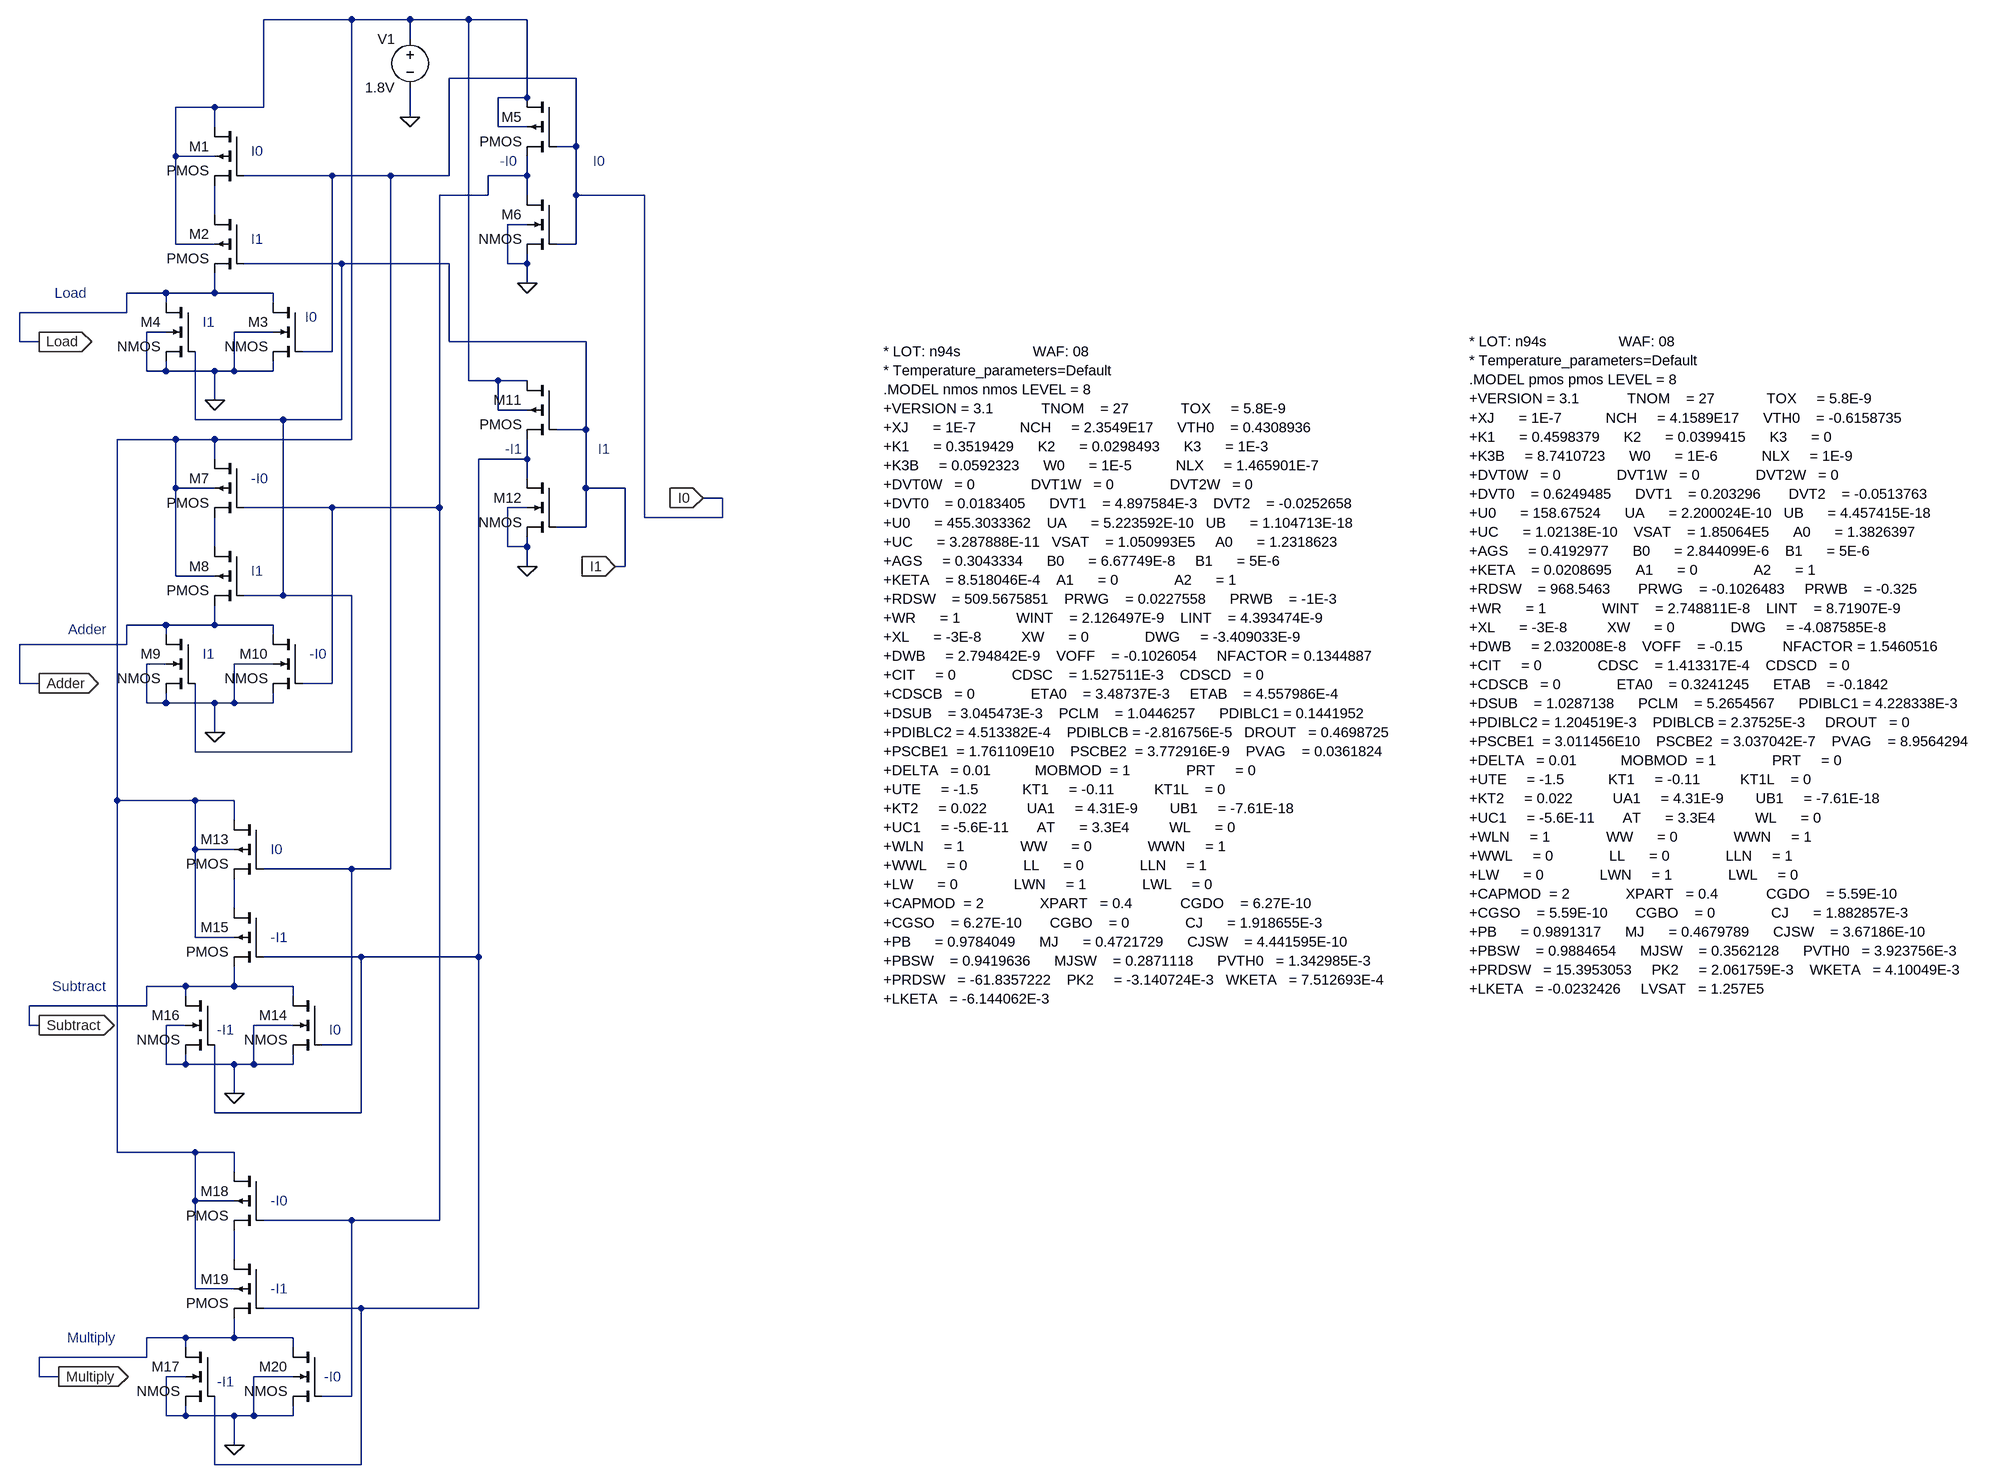
[diagram p0: schematic Command_decoder.asc]
Command_decoder.asc, the LTspice schematic file:
Version 4
SHEET 1 2008 1636
WIRE -704 -736 -848 -736
WIRE -608 -736 -704 -736
WIRE -512 -736 -608 -736
WIRE -416 -736 -512 -736
WIRE -608 -704 -608 -736
WIRE -336 -640 -544 -640
WIRE -416 -608 -416 -736
WIRE -416 -608 -464 -608
WIRE -928 -592 -992 -592
WIRE -848 -592 -848 -736
WIRE -848 -592 -928 -592
WIRE -608 -576 -608 -624
WIRE -928 -560 -928 -592
WIRE -464 -560 -464 -608
WIRE -416 -560 -464 -560
WIRE -336 -528 -336 -640
WIRE -336 -528 -368 -528
WIRE -992 -512 -992 -592
WIRE -928 -512 -992 -512
WIRE -736 -480 -880 -480
WIRE -640 -480 -736 -480
WIRE -544 -480 -544 -640
WIRE -544 -480 -640 -480
WIRE -416 -480 -416 -512
WIRE -416 -480 -480 -480
WIRE -480 -448 -480 -480
WIRE -480 -448 -560 -448
WIRE -416 -448 -416 -480
WIRE -336 -448 -336 -528
WIRE -224 -448 -336 -448
WIRE -928 -416 -928 -464
WIRE -416 -400 -448 -400
WIRE -992 -368 -992 -512
WIRE -928 -368 -992 -368
WIRE -336 -368 -336 -448
WIRE -336 -368 -368 -368
WIRE -720 -336 -880 -336
WIRE -544 -336 -720 -336
WIRE -448 -336 -448 -400
WIRE -416 -336 -416 -352
WIRE -416 -336 -448 -336
WIRE -416 -304 -416 -336
WIRE -1008 -288 -1072 -288
WIRE -928 -288 -928 -320
WIRE -928 -288 -1008 -288
WIRE -832 -288 -928 -288
WIRE -1008 -272 -1008 -288
WIRE -832 -272 -832 -288
WIRE -1072 -256 -1072 -288
WIRE -1072 -256 -1248 -256
WIRE -1008 -224 -1040 -224
WIRE -832 -224 -896 -224
WIRE -1248 -208 -1248 -256
WIRE -1216 -208 -1248 -208
WIRE -544 -208 -544 -336
WIRE -320 -208 -544 -208
WIRE -736 -192 -736 -480
WIRE -736 -192 -784 -192
WIRE -1040 -160 -1040 -224
WIRE -1008 -160 -1008 -176
WIRE -1008 -160 -1040 -160
WIRE -928 -160 -1008 -160
WIRE -896 -160 -896 -224
WIRE -896 -160 -928 -160
WIRE -832 -160 -832 -176
WIRE -832 -160 -896 -160
WIRE -512 -144 -512 -736
WIRE -464 -144 -512 -144
WIRE -416 -144 -464 -144
WIRE -928 -112 -928 -160
WIRE -464 -96 -464 -144
WIRE -416 -96 -464 -96
WIRE -960 -80 -960 -192
WIRE -816 -80 -960 -80
WIRE -720 -80 -720 -336
WIRE -720 -80 -816 -80
WIRE -320 -64 -320 -208
WIRE -320 -64 -368 -64
WIRE -992 -48 -1088 -48
WIRE -928 -48 -992 -48
WIRE -704 -48 -704 -736
WIRE -704 -48 -928 -48
WIRE -928 -16 -928 -48
WIRE -416 -16 -416 -48
WIRE -416 -16 -496 -16
WIRE -416 16 -416 -16
WIRE -992 32 -992 -48
WIRE -928 32 -992 32
WIRE -320 32 -320 -64
WIRE -256 32 -320 32
WIRE -96 48 -128 48
WIRE -736 64 -880 64
WIRE -560 64 -560 -448
WIRE -560 64 -736 64
WIRE -416 64 -448 64
WIRE -224 80 -224 -448
WIRE -96 80 -96 48
WIRE -96 80 -224 80
WIRE -320 96 -320 32
WIRE -320 96 -368 96
WIRE -928 128 -928 80
WIRE -448 128 -448 64
WIRE -416 128 -416 112
WIRE -416 128 -448 128
WIRE -416 160 -416 128
WIRE -256 160 -256 32
WIRE -256 160 -272 160
WIRE -992 176 -992 32
WIRE -928 176 -992 176
WIRE -816 208 -816 -80
WIRE -816 208 -880 208
WIRE -704 208 -816 208
WIRE -1008 256 -1072 256
WIRE -928 256 -928 224
WIRE -928 256 -1008 256
WIRE -832 256 -928 256
WIRE -1008 272 -1008 256
WIRE -832 272 -832 256
WIRE -1072 288 -1072 256
WIRE -1072 288 -1248 288
WIRE -1008 320 -1040 320
WIRE -832 320 -896 320
WIRE -1248 352 -1248 288
WIRE -1216 352 -1248 352
WIRE -736 352 -736 64
WIRE -736 352 -784 352
WIRE -1040 384 -1040 320
WIRE -1008 384 -1008 368
WIRE -1008 384 -1040 384
WIRE -928 384 -1008 384
WIRE -896 384 -896 320
WIRE -896 384 -928 384
WIRE -832 384 -832 368
WIRE -832 384 -896 384
WIRE -928 432 -928 384
WIRE -960 464 -960 352
WIRE -704 464 -704 208
WIRE -704 464 -960 464
WIRE -1088 544 -1088 -48
WIRE -960 544 -1088 544
WIRE -896 544 -960 544
WIRE -896 576 -896 544
WIRE -960 624 -960 544
WIRE -896 624 -960 624
WIRE -704 656 -848 656
WIRE -640 656 -640 -480
WIRE -640 656 -704 656
WIRE -896 720 -896 672
WIRE -960 768 -960 624
WIRE -896 768 -960 768
WIRE -688 800 -848 800
WIRE -496 800 -496 -16
WIRE -496 800 -688 800
WIRE -976 848 -1040 848
WIRE -896 848 -896 816
WIRE -896 848 -976 848
WIRE -800 848 -896 848
WIRE -976 864 -976 848
WIRE -800 864 -800 848
WIRE -1040 880 -1040 848
WIRE -1040 880 -1232 880
WIRE -1232 912 -1232 880
WIRE -1216 912 -1232 912
WIRE -976 912 -1008 912
WIRE -800 912 -864 912
WIRE -704 944 -704 656
WIRE -704 944 -752 944
WIRE -1008 976 -1008 912
WIRE -976 976 -976 960
WIRE -976 976 -1008 976
WIRE -896 976 -976 976
WIRE -864 976 -864 912
WIRE -864 976 -896 976
WIRE -800 976 -800 960
WIRE -800 976 -864 976
WIRE -896 1024 -896 976
WIRE -928 1056 -928 944
WIRE -688 1056 -688 800
WIRE -688 1056 -928 1056
WIRE -1088 1120 -1088 544
WIRE -960 1120 -1088 1120
WIRE -896 1120 -960 1120
WIRE -896 1152 -896 1120
WIRE -960 1200 -960 1120
WIRE -896 1200 -960 1200
WIRE -704 1232 -848 1232
WIRE -560 1232 -560 64
WIRE -560 1232 -704 1232
WIRE -896 1296 -896 1248
WIRE -960 1344 -960 1200
WIRE -896 1344 -960 1344
WIRE -688 1376 -848 1376
WIRE -496 1376 -496 800
WIRE -496 1376 -688 1376
WIRE -976 1424 -1040 1424
WIRE -896 1424 -896 1392
WIRE -896 1424 -976 1424
WIRE -800 1424 -896 1424
WIRE -976 1440 -976 1424
WIRE -800 1440 -800 1424
WIRE -1040 1456 -1040 1424
WIRE -1040 1456 -1216 1456
WIRE -1216 1488 -1216 1456
WIRE -1184 1488 -1216 1488
WIRE -976 1488 -1008 1488
WIRE -800 1488 -864 1488
WIRE -704 1520 -704 1232
WIRE -704 1520 -752 1520
WIRE -1008 1552 -1008 1488
WIRE -976 1552 -976 1536
WIRE -976 1552 -1008 1552
WIRE -896 1552 -976 1552
WIRE -864 1552 -864 1488
WIRE -864 1552 -896 1552
WIRE -800 1552 -800 1536
WIRE -800 1552 -864 1552
WIRE -896 1600 -896 1552
WIRE -928 1632 -928 1520
WIRE -688 1632 -688 1376
WIRE -688 1632 -928 1632
FLAG -608 -576 0
FLAG -928 -112 0
FLAG -928 432 0
FLAG -416 -304 0
FLAG -416 160 0
FLAG -896 1024 0
FLAG -896 1600 0
FLAG -128 48 I0
IOPIN -128 48 In
FLAG -272 160 I1
IOPIN -272 160 In
FLAG -1216 -208 Load
IOPIN -1216 -208 Out
FLAG -1216 352 Adder
IOPIN -1216 352 Out
FLAG -1216 912 Subtract
IOPIN -1216 912 Out
FLAG -1184 1488 Multiply
IOPIN -1184 1488 Out
SYMBOL voltage -608 -720 M0
WINDOW 123 0 0 Left 0
WINDOW 39 0 0 Left 0
SYMATTR InstName V1
SYMATTR Value 1.8V
SYMBOL pmos4 -880 -560 M0
SYMATTR InstName M1
SYMATTR Value2 l=180n w=4400n
SYMBOL pmos4 -880 -416 M0
SYMATTR InstName M2
SYMATTR Value2 l=180n w=4400n
SYMBOL nmos4 -784 -272 M0
SYMATTR InstName M3
SYMATTR Value2 l=180n w=2200n
SYMBOL nmos4 -960 -272 M0
SYMATTR InstName M4
SYMATTR Value2 l=180n w=2200n
SYMBOL pmos4 -368 -608 M0
SYMATTR InstName M5
SYMATTR Value2 l=180n w=3000n
SYMBOL nmos4 -368 -448 M0
SYMATTR InstName M6
SYMATTR Value2 l=180n w=1500n
SYMBOL pmos4 -880 -16 M0
SYMATTR InstName M7
SYMATTR Value2 l=180n w=4400n
SYMBOL pmos4 -880 128 M0
SYMATTR InstName M8
SYMATTR Value2 l=180n w=4400n
SYMBOL nmos4 -960 272 M0
SYMATTR InstName M9
SYMATTR Value2 l=180n w=2200n
SYMBOL nmos4 -784 272 M0
SYMATTR InstName M10
SYMATTR Value2 l=180n w=2200n
SYMBOL pmos4 -368 -144 M0
SYMATTR InstName M11
SYMATTR Value2 l=180n w=3000n
SYMBOL nmos4 -368 16 M0
SYMATTR InstName M12
SYMATTR Value2 l=180n w=1500n
SYMBOL pmos4 -848 576 M0
SYMATTR InstName M13
SYMATTR Value2 l=180n w=4400n
SYMBOL nmos4 -752 864 M0
SYMATTR InstName M14
SYMATTR Value2 l=180n w=2200n
SYMBOL pmos4 -848 720 M0
SYMATTR InstName M15
SYMATTR Value2 l=180n w=4400n
SYMBOL nmos4 -928 864 M0
SYMATTR InstName M16
SYMATTR Value2 l=180n w=2200n
SYMBOL nmos4 -928 1440 M0
SYMATTR InstName M17
SYMATTR Value2 l=180n w=2200n
SYMBOL pmos4 -848 1152 M0
SYMATTR InstName M18
SYMATTR Value2 l=180n w=4400n
SYMBOL pmos4 -848 1296 M0
SYMATTR InstName M19
SYMATTR Value2 l=180n w=4400n
SYMBOL nmos4 -752 1440 M0
SYMATTR InstName M20
SYMATTR Value2 l=180n w=2200n
TEXT -848 -520 Right 2 ;I0
TEXT -848 -376 Right 2 ;I1
TEXT -760 -248 Right 2 ;I0
TEXT -928 -240 Right 2 ;I1
TEXT -1136 -288 Right 2 ;Load
TEXT -848 168 Right 2 ;I1
TEXT -928 304 Right 2 ;I1
TEXT -840 16 Right 2 ;-I0
TEXT -744 304 Right 2 ;-I0
TEXT -288 -504 Right 2 ;I0
TEXT -280 -32 Right 2 ;I1
TEXT -432 -504 Right 2 ;-I0
TEXT -424 -32 Right 2 ;-I1
TEXT -1104 264 Right 2 ;Adder
TEXT -816 624 Right 2 ;I0
TEXT -720 920 Right 2 ;I0
TEXT -808 768 Right 2 ;-I1
TEXT -896 920 Right 2 ;-I1
TEXT -808 1344 Right 2 ;-I1
TEXT -896 1496 Right 2 ;-I1
TEXT -1104 848 Right 2 ;Subtract
TEXT -808 1200 Right 2 ;-I0
TEXT -720 1488 Right 2 ;-I0
TEXT -1088 1424 Right 2 ;Multiply
TEXT 168 -192 Left 2 !* LOT: n94s                  WAF: 08\n* Temperature_parameters=Default\n.MODEL nmos nmos LEVEL = 8\n+VERSION = 3.1            TNOM    = 27             TOX     = 5.8E-9\n+XJ      = 1E-7           NCH     = 2.3549E17      VTH0    = 0.4308936\n+K1      = 0.3519429      K2      = 0.0298493      K3      = 1E-3\n+K3B     = 0.0592323      W0      = 1E-5           NLX     = 1.465901E-7\n+DVT0W   = 0              DVT1W   = 0              DVT2W   = 0\n+DVT0    = 0.0183405      DVT1    = 4.897584E-3    DVT2    = -0.0252658\n+U0      = 455.3033362    UA      = 5.223592E-10   UB      = 1.104713E-18\n+UC      = 3.287888E-11   VSAT    = 1.050993E5     A0      = 1.2318623\n+AGS     = 0.3043334      B0      = 6.67749E-8     B1      = 5E-6\n+KETA    = 8.518046E-4    A1      = 0              A2      = 1\n+RDSW    = 509.5675851    PRWG    = 0.0227558      PRWB    = -1E-3\n+WR      = 1              WINT    = 2.126497E-9    LINT    = 4.393474E-9\n+XL      = -3E-8          XW      = 0              DWG     = -3.409033E-9\n+DWB     = 2.794842E-9    VOFF    = -0.1026054     NFACTOR = 0.1344887\n+CIT     = 0              CDSC    = 1.527511E-3    CDSCD   = 0\n+CDSCB   = 0              ETA0    = 3.48737E-3     ETAB    = 4.557986E-4\n+DSUB    = 3.045473E-3    PCLM    = 1.0446257      PDIBLC1 = 0.1441952\n+PDIBLC2 = 4.513382E-4    PDIBLCB = -2.816756E-5   DROUT   = 0.4698725\n+PSCBE1  = 1.761109E10    PSCBE2  = 3.772916E-9    PVAG    = 0.0361824\n+DELTA   = 0.01           MOBMOD  = 1              PRT     = 0\n+UTE     = -1.5           KT1     = -0.11          KT1L    = 0\n+KT2     = 0.022          UA1     = 4.31E-9        UB1     = -7.61E-18\n+UC1     = -5.6E-11       AT      = 3.3E4          WL      = 0\n+WLN     = 1              WW      = 0              WWN     = 1\n+WWL     = 0              LL      = 0              LLN     = 1\n+LW      = 0              LWN     = 1              LWL     = 0\n+CAPMOD  = 2              XPART   = 0.4            CGDO    = 6.27E-10\n+CGSO    = 6.27E-10       CGBO    = 0              CJ      = 1.918655E-3\n+PB      = 0.9784049      MJ      = 0.4721729      CJSW    = 4.441595E-10\n+PBSW    = 0.9419636      MJSW    = 0.2871118      PVTH0   = 1.342985E-3\n+PRDSW   = -61.8357222    PK2     = -3.140724E-3   WKETA   = 7.512693E-4\n+LKETA   = -6.144062E-3
TEXT 1128 -208 Left 2 !* LOT: n94s                  WAF: 08\n* Temperature_parameters=Default\n.MODEL pmos pmos LEVEL = 8\n+VERSION = 3.1            TNOM    = 27             TOX     = 5.8E-9\n+XJ      = 1E-7           NCH     = 4.1589E17      VTH0    = -0.6158735\n+K1      = 0.4598379      K2      = 0.0399415      K3      = 0\n+K3B     = 8.7410723      W0      = 1E-6           NLX     = 1E-9\n+DVT0W   = 0              DVT1W   = 0              DVT2W   = 0\n+DVT0    = 0.6249485      DVT1    = 0.203296       DVT2    = -0.0513763\n+U0      = 158.67524      UA      = 2.200024E-10   UB      = 4.457415E-18\n+UC      = 1.02138E-10    VSAT    = 1.85064E5      A0      = 1.3826397\n+AGS     = 0.4192977      B0      = 2.844099E-6    B1      = 5E-6\n+KETA    = 0.0208695      A1      = 0              A2      = 1\n+RDSW    = 968.5463       PRWG    = -0.1026483     PRWB    = -0.325\n+WR      = 1              WINT    = 2.748811E-8    LINT    = 8.71907E-9\n+XL      = -3E-8          XW      = 0              DWG     = -4.087585E-8\n+DWB     = 2.032008E-8    VOFF    = -0.15          NFACTOR = 1.5460516\n+CIT     = 0              CDSC    = 1.413317E-4    CDSCD   = 0\n+CDSCB   = 0              ETA0    = 0.3241245      ETAB    = -0.1842\n+DSUB    = 1.0287138      PCLM    = 5.2654567      PDIBLC1 = 4.228338E-3\n+PDIBLC2 = 1.204519E-3    PDIBLCB = 2.37525E-3     DROUT   = 0\n+PSCBE1  = 3.011456E10    PSCBE2  = 3.037042E-7    PVAG    = 8.9564294\n+DELTA   = 0.01           MOBMOD  = 1              PRT     = 0\n+UTE     = -1.5           KT1     = -0.11          KT1L    = 0\n+KT2     = 0.022          UA1     = 4.31E-9        UB1     = -7.61E-18\n+UC1     = -5.6E-11       AT      = 3.3E4          WL      = 0\n+WLN     = 1              WW      = 0              WWN     = 1\n+WWL     = 0              LL      = 0              LLN     = 1\n+LW      = 0              LWN     = 1              LWL     = 0\n+CAPMOD  = 2              XPART   = 0.4            CGDO    = 5.59E-10\n+CGSO    = 5.59E-10       CGBO    = 0              CJ      = 1.882857E-3\n+PB      = 0.9891317      MJ      = 0.4679789      CJSW    = 3.67186E-10\n+PBSW    = 0.9884654      MJSW    = 0.3562128      PVTH0   = 3.923756E-3\n+PRDSW   = 15.3953053     PK2     = 2.061759E-3    WKETA   = 4.10049E-3\n+LKETA   = -0.0232426     LVSAT   = 1.257E5

The netlist it stands for:
* Command_decoder.asc
V1 N001 0 1.8V
M1 N001 I0 N003 N001 PMOS l=180n w=4400n
M2 N003 I1 Load N001 PMOS l=180n w=4400n
M3 Load I0 0 0 NMOS l=180n w=2200n
M4 Load I1 0 0 NMOS l=180n w=2200n
M5 N001 I0 N002 N001 PMOS l=180n w=3000n
M6 N002 I0 0 0 NMOS l=180n w=1500n
M7 N001 N002 N005 N001 PMOS l=180n w=4400n
M8 N005 I1 Adder N001 PMOS l=180n w=4400n
M9 Adder I1 0 0 NMOS l=180n w=2200n
M10 Adder N002 0 0 NMOS l=180n w=2200n
M11 N001 I1 N004 N001 PMOS l=180n w=3000n
M12 N004 I1 0 0 NMOS l=180n w=1500n
M13 N001 I0 N006 N001 PMOS l=180n w=4400n
M14 Subtract I0 0 0 NMOS l=180n w=2200n
M15 N006 N004 Subtract N001 PMOS l=180n w=4400n
M16 Subtract N004 0 0 NMOS l=180n w=2200n
M17 Multiply N004 0 0 NMOS l=180n w=2200n
M18 N001 N002 N007 N001 PMOS l=180n w=4400n
M19 N007 N004 Multiply N001 PMOS l=180n w=4400n
M20 Multiply N002 0 0 NMOS l=180n w=2200n
.model NMOS NMOS
.model PMOS PMOS
.lib standard.mos
* I0
* I1
* I0
* I1
* Load
* I1
* I1
* -I0
* -I0
* I0
* I1
* -I0
* -I1
* Adder
* I0
* I0
* -I1
* -I1
* -I1
* -I1
* Subtract
* -I0
* -I0
* Multiply
* LOT: n94s                  WAF: 08
* Temperature_parameters=Default
.MODEL nmos nmos LEVEL = 8
+VERSION = 3.1            TNOM    = 27             TOX     = 5.8E-9
+XJ      = 1E-7           NCH     = 2.3549E17      VTH0    = 0.4308936
+K1      = 0.3519429      K2      = 0.0298493      K3      = 1E-3
+K3B     = 0.0592323      W0      = 1E-5           NLX     = 1.465901E-7
+DVT0W   = 0              DVT1W   = 0              DVT2W   = 0
+DVT0    = 0.0183405      DVT1    = 4.897584E-3    DVT2    = -0.0252658
+U0      = 455.3033362    UA      = 5.223592E-10   UB      = 1.104713E-18
+UC      = 3.287888E-11   VSAT    = 1.050993E5     A0      = 1.2318623
+AGS     = 0.3043334      B0      = 6.67749E-8     B1      = 5E-6
+KETA    = 8.518046E-4    A1      = 0              A2      = 1
+RDSW    = 509.5675851    PRWG    = 0.0227558      PRWB    = -1E-3
+WR      = 1              WINT    = 2.126497E-9    LINT    = 4.393474E-9
+XL      = -3E-8          XW      = 0              DWG     = -3.409033E-9
+DWB     = 2.794842E-9    VOFF    = -0.1026054     NFACTOR = 0.1344887
+CIT     = 0              CDSC    = 1.527511E-3    CDSCD   = 0
+CDSCB   = 0              ETA0    = 3.48737E-3     ETAB    = 4.557986E-4
+DSUB    = 3.045473E-3    PCLM    = 1.0446257      PDIBLC1 = 0.1441952
+PDIBLC2 = 4.513382E-4    PDIBLCB = -2.816756E-5   DROUT   = 0.4698725
+PSCBE1  = 1.761109E10    PSCBE2  = 3.772916E-9    PVAG    = 0.0361824
+DELTA   = 0.01           MOBMOD  = 1              PRT     = 0
+UTE     = -1.5           KT1     = -0.11          KT1L    = 0
+KT2     = 0.022          UA1     = 4.31E-9        UB1     = -7.61E-18
+UC1     = -5.6E-11       AT      = 3.3E4          WL      = 0
+WLN     = 1              WW      = 0              WWN     = 1
+WWL     = 0              LL      = 0              LLN     = 1
+LW      = 0              LWN     = 1              LWL     = 0
+CAPMOD  = 2              XPART   = 0.4            CGDO    = 6.27E-10
+CGSO    = 6.27E-10       CGBO    = 0              CJ      = 1.918655E-3
+PB      = 0.9784049      MJ      = 0.4721729      CJSW    = 4.441595E-10
+PBSW    = 0.9419636      MJSW    = 0.2871118      PVTH0   = 1.342985E-3
+PRDSW   = -61.8357222    PK2     = -3.140724E-3   WKETA   = 7.512693E-4
+LKETA   = -6.144062E-3
* LOT: n94s                  WAF: 08
* Temperature_parameters=Default
.MODEL pmos pmos LEVEL = 8
+VERSION = 3.1            TNOM    = 27             TOX     = 5.8E-9
+XJ      = 1E-7           NCH     = 4.1589E17      VTH0    = -0.6158735
+K1      = 0.4598379      K2      = 0.0399415      K3      = 0
+K3B     = 8.7410723      W0      = 1E-6           NLX     = 1E-9
+DVT0W   = 0              DVT1W   = 0              DVT2W   = 0
+DVT0    = 0.6249485      DVT1    = 0.203296       DVT2    = -0.0513763
+U0      = 158.67524      UA      = 2.200024E-10   UB      = 4.457415E-18
+UC      = 1.02138E-10    VSAT    = 1.85064E5      A0      = 1.3826397
+AGS     = 0.4192977      B0      = 2.844099E-6    B1      = 5E-6
+KETA    = 0.0208695      A1      = 0              A2      = 1
+RDSW    = 968.5463       PRWG    = -0.1026483     PRWB    = -0.325
+WR      = 1              WINT    = 2.748811E-8    LINT    = 8.71907E-9
+XL      = -3E-8          XW      = 0              DWG     = -4.087585E-8
+DWB     = 2.032008E-8    VOFF    = -0.15          NFACTOR = 1.5460516
+CIT     = 0              CDSC    = 1.413317E-4    CDSCD   = 0
+CDSCB   = 0              ETA0    = 0.3241245      ETAB    = -0.1842
+DSUB    = 1.0287138      PCLM    = 5.2654567      PDIBLC1 = 4.228338E-3
+PDIBLC2 = 1.204519E-3    PDIBLCB = 2.37525E-3     DROUT   = 0
+PSCBE1  = 3.011456E10    PSCBE2  = 3.037042E-7    PVAG    = 8.9564294
+DELTA   = 0.01           MOBMOD  = 1              PRT     = 0
+UTE     = -1.5           KT1     = -0.11          KT1L    = 0
+KT2     = 0.022          UA1     = 4.31E-9        UB1     = -7.61E-18
+UC1     = -5.6E-11       AT      = 3.3E4          WL      = 0
+WLN     = 1              WW      = 0              WWN     = 1
+WWL     = 0              LL      = 0              LLN     = 1
+LW      = 0              LWN     = 1              LWL     = 0
+CAPMOD  = 2              XPART   = 0.4            CGDO    = 5.59E-10
+CGSO    = 5.59E-10       CGBO    = 0              CJ      = 1.882857E-3
+PB      = 0.9891317      MJ      = 0.4679789      CJSW    = 3.67186E-10
+PBSW    = 0.9884654      MJSW    = 0.3562128      PVTH0   = 3.923756E-3
+PRDSW   = 15.3953053     PK2     = 2.061759E-3    WKETA   = 4.10049E-3
+LKETA   = -0.0232426     LVSAT   = 1.257E5
.backanno
.end